# Altium schematic sheet Sheet1.SchDoc
size A4
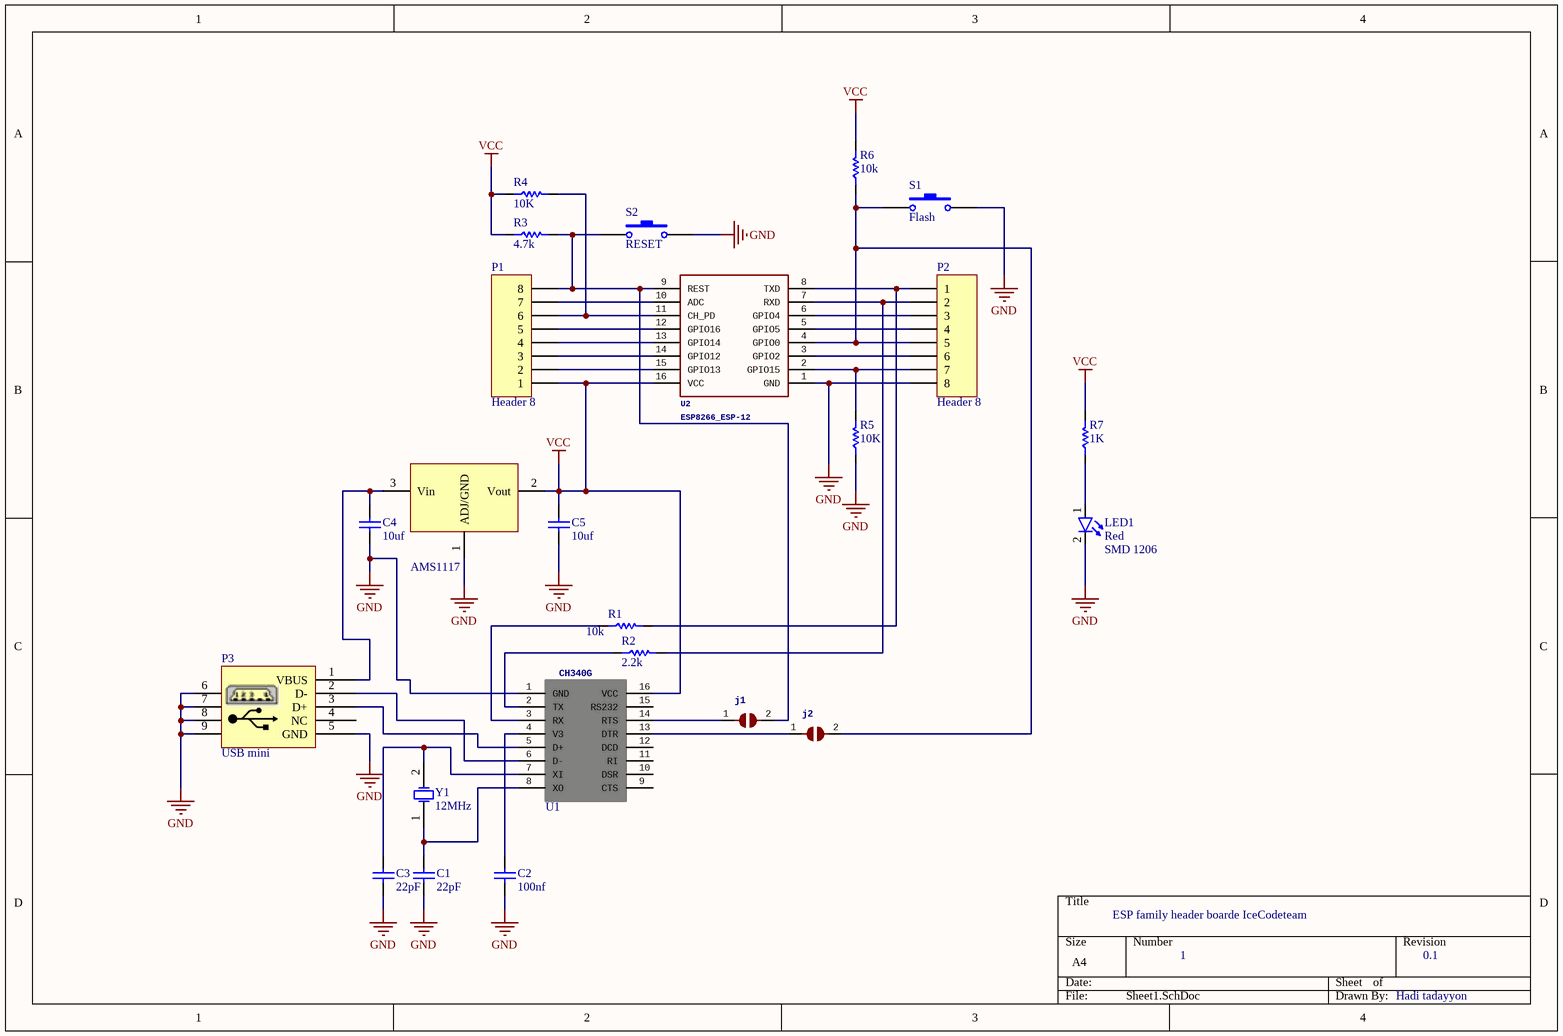
[diagram p0: Sheet1.SchDoc]

## Parts
AMS1117  AMS1117  [SOT-223-3]  (value not drawn)
C1  value 22pF  [C1206]  (hidden comment: Cap Semi)
C2  value 100nf  [C1206]  (hidden comment: Cap Semi)
C3  value 22pF  [C1206]  (hidden comment: Cap Semi)
C4  value 10uf  [C1206]  (hidden comment: Cap Semi)
C5  value 10uf  [C1206]  (hidden comment: Cap Semi)
j1  j1  [jmp]  (value not drawn)
j2  j1  [jmp]  (value not drawn)
LED1  Size: SMD 1206  [LED SMD 1206]  (hidden comment: Red)
P1  Header 8  [HDR1X8]
P2  Header 8  [HDR1X8]
P3  USB mini  [microUSB]
R1  10k  [RES 1206 (3216X08L)]
R2  2.2k  [RES 1206 (3216X08L)]
R3  4.7k  [RES 1206 (3216X08L)]
R4  10K  [RES 1206 (3216X08L)]
R5  10K  [RES 1206 (3216X08L)]
R6  10k  [RES 1206 (3216X08L)]
R7  1K  [RES 1206 (3216X08L)]
S1  Flash  [3*6*2.5BTN]
S2  RESET  [3*6*2.5BTN]
U1  CH340G  [sop16]
U2  ESP8266_ESP-12  [ESP-12s]
Y1  12MHz  [Crystal SMD]

## Nets
GND: AMS1117.1(ADJ/GND) C1.1 C2.1 C3.1 C4.1 C5.1 LED1.2(K) P2.8 P3.5(GND) P3.6 P3.7 P3.8 P3.9 R5.1 S1.2 S2.2 U1.1(GND) U2.1(GND)
VCC: AMS1117.2(Vout) C5.2 P1.1 R3.1 R4.1 R6.2 R7.2 U1.16(VCC) U2.16(VCC)
NetAMS1117_3: AMS1117.3(Vin) C4.2 P3.1(VBUS)
NetC1_2: C1.2 U1.8(XO) Y1.1(OSC1)
NetC2_2: C2.2 U1.4(V3)
NetC3_2: C3.2 U1.7(XI) Y1.2(OSC2)
Netj1_1: j1.1 U1.14(RTS)
Netj1_2: j1.2 P1.8 R3.2 S2.1 U2.9(REST)
Netj2_1: j2.1 U1.13(DTR)
Netj2_2: j2.2 P2.5 R6.1 S1.1 U2.4(GPIO0)
NetLED1_1: LED1.1(A) R7.1
NetP1_2: P1.2 U2.15(GPIO13)
NetP1_3: P1.3 U2.14(GPIO12)
NetP1_4: P1.4 U2.13(GPIO14)
NetP1_5: P1.5 U2.12(GPIO16)
NetP1_6: P1.6 R4.2 U2.11(CH_PD)
NetP1_7: P1.7 U2.10(ADC)
NetP2_1: P2.1 R1.2 U2.8(TXD)
NetP2_2: P2.2 R2.2 U2.7(RXD)
NetP2_3: P2.3 U2.6(GPIO4)
NetP2_4: P2.4 U2.5(GPIO5)
NetP2_6: P2.6 U2.3(GPIO2)
NetP2_7: P2.7 R5.2 U2.2(GPIO15)
NetP3_2: P3.2(D-) U1.6(D-)
NetP3_3: P3.3(D+) U1.5(D+)
NetR1_1: R1.1 U1.3(RX)
NetR2_1: R2.1 U1.2(TX)

Not connected (* = marked no-connect by the designer): P3 4(NC); U1 9(CTS) 10(DSR) 11(RI) 12(DCD) 15(RS232)

## Notes on the sheet
- ESP family header boarde IceCodeteam
- 1
- 0.1
- Hadi tadayyon

## Library data of the parts
AMS1117 = AMS1117: LDO 3.3V/5V/12V
C1-C5 = Cap Semi: Capacitor (Semiconductor SIM Model); Published: 8-Jun-2000; LatestRevisionDate: 29-May-2009; LatestRevisionNote: IPC-7351 Footprint Added.; PackageReference: C1206; Publisher: Altium Limited; PackageDescription: Chip Capacitor
j1 j2 = SJ: SMD solder JUMPER; GateName_1: 1; SymbolName_1: SJ; LibraryName: jumper; DeviceSetName: SJ
LED1 = LED: Designer: Saeid Jorablo; Organazation: ControTec; Adding Date: 1387/12/22; Color: Red
P1 P2 = Header 8: Header, 8-Pin; LatestRevisionDate: 17-Jul-2002; LatestRevisionNote: Re-released for DXP Platform.; Publisher: Altium Limited
P3 = USB mini: mini USB Connector
R1-R7 = Resistor: Tolerance: 5%; Power: 1/8 W
  R1 R6: Value: 10k
  R2: Value: 2.2k
  R3: Value: 4.7k
  R4 R5: Value: 10K
  R7: Value: 1K
S1 S2 = Switch PB: Push Button Switch
U1 = CH340G: GateName_1: G$1; SymbolName_1: CH340G; LibraryName: usb-serial; DeviceSetName: CH340G; CH340G: CH340G
U2 = ESP8266_ESP-12: GateName_1: G$1; SymbolName_1: ESP12; LibraryName: ESP8266-ESP12; DeviceSetName: ESP8266_ESP-12; ESP8266_ESP-12: ESP8266_ESP-12
Y1 = XTAL: XTAL Crystal; Company: E.P.I.L; Design Date: 11/04/2011; Value: 12MHz